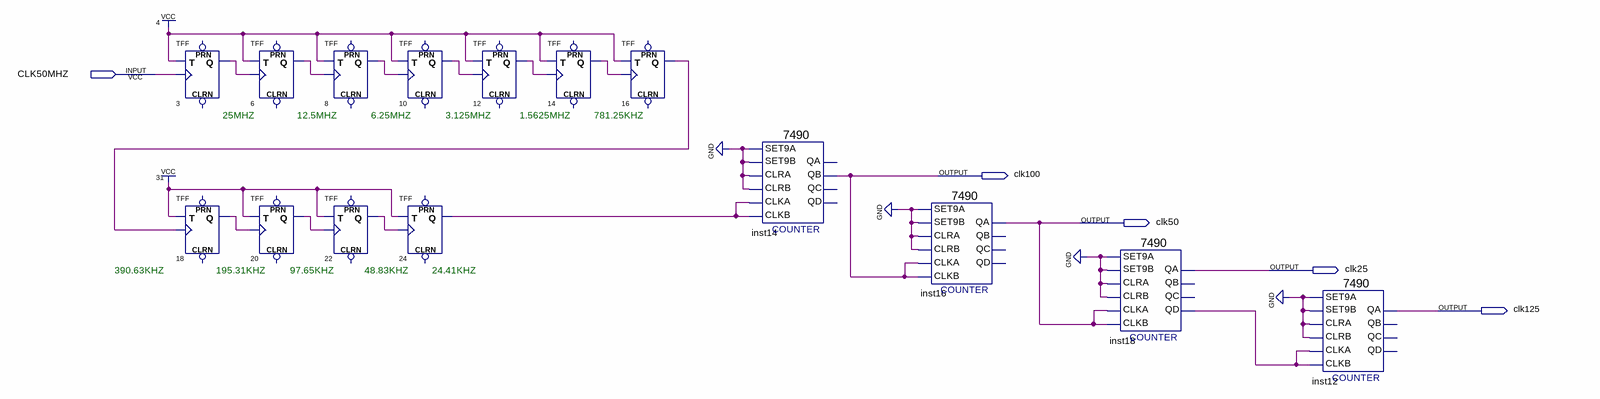
[diagram p0: schematic sheet]
// Quartus schematic CLKDIV25.bdf as structural Verilog: 15 symbols, 5 pins
module CLKDIV25 (
  input  CLK50MHZ,
  output clk100,
  output clk50,
  output clk25,
  output clk125
);

  wire inst18_qd, n3_q, n6_q, n8_q, n10_q, n12_q, n14_q, n16_q, n18_q, n20_q, n22_q, n24_q;

  TFF u_3 (.T(1'b1), .CLK(CLK50MHZ), .Q(n3_q));  // open: PRN, CLRN
  TFF u_18 (.T(1'b1), .CLK(n16_q), .Q(n18_q));  // open: PRN, CLRN
  TFF u_6 (.T(1'b1), .CLK(n3_q), .Q(n6_q));  // open: PRN, CLRN
  TFF u_20 (.T(1'b1), .CLK(n18_q), .Q(n20_q));  // open: PRN, CLRN
  TFF u_8 (.T(1'b1), .CLK(n6_q), .Q(n8_q));  // open: PRN, CLRN
  TFF u_22 (.T(1'b1), .CLK(n20_q), .Q(n22_q));  // open: PRN, CLRN
  TFF u_10 (.T(1'b1), .CLK(n8_q), .Q(n10_q));  // open: PRN, CLRN
  TFF u_24 (.T(1'b1), .CLK(n22_q), .Q(n24_q));  // open: PRN, CLRN
  TFF u_12 (.T(1'b1), .CLK(n10_q), .Q(n12_q));  // open: PRN, CLRN
  TFF u_14 (.T(1'b1), .CLK(n12_q), .Q(n14_q));  // open: PRN, CLRN
  TFF u_16 (.T(1'b1), .CLK(n14_q), .Q(n16_q));  // open: PRN, CLRN
  \7490  inst14 (
    .SET9A(1'b0), .CLRA(1'b0), .SET9B(1'b0), .CLKB(n24_q), .CLKA(n24_q), .CLRB(1'b0), .QB(clk100));  // open: QD, QA, QC
  \7490  inst16 (
    .SET9A(1'b0), .CLRA(1'b0), .SET9B(1'b0), .CLKB(clk100), .CLKA(clk100), .CLRB(1'b0), .QA(clk50));  // open: QD, QB, QC
  \7490  inst18 (
    .SET9A(1'b0), .CLRA(1'b0), .SET9B(1'b0), .CLKB(clk50), .CLKA(clk50), .CLRB(1'b0), .QD(inst18_qd),
    .QA(clk25));  // open: QB, QC
  \7490  inst12 (
    .SET9A(1'b0), .CLRA(1'b0), .SET9B(1'b0), .CLKB(inst18_qd), .CLKA(inst18_qd), .CLRB(1'b0), .QA(clk125));  // open: QD, QB, QC

  // Notes on the sheet:
  //   25MHZ
  //   12.5MHZ
  //   6.25MHZ
  //   3.125MHZ
  //   1.5625MHZ
  //   781.25KHZ
  //   390.63KHZ
  //   195.31KHZ
  //   97.65KHZ
  //   48.83KHZ
  //   24.41KHZ
endmodule
